# Altium schematic sheet ADC.SchDoc: ADC
size A; Organization: UCLA High Energy Physics; DocumentNumber: 8; Revision: 2.0; SheetNumber: 8; SheetTotal: 23; CurrentDate: 9/6/2018; ModifiedDate: 9/6/2018
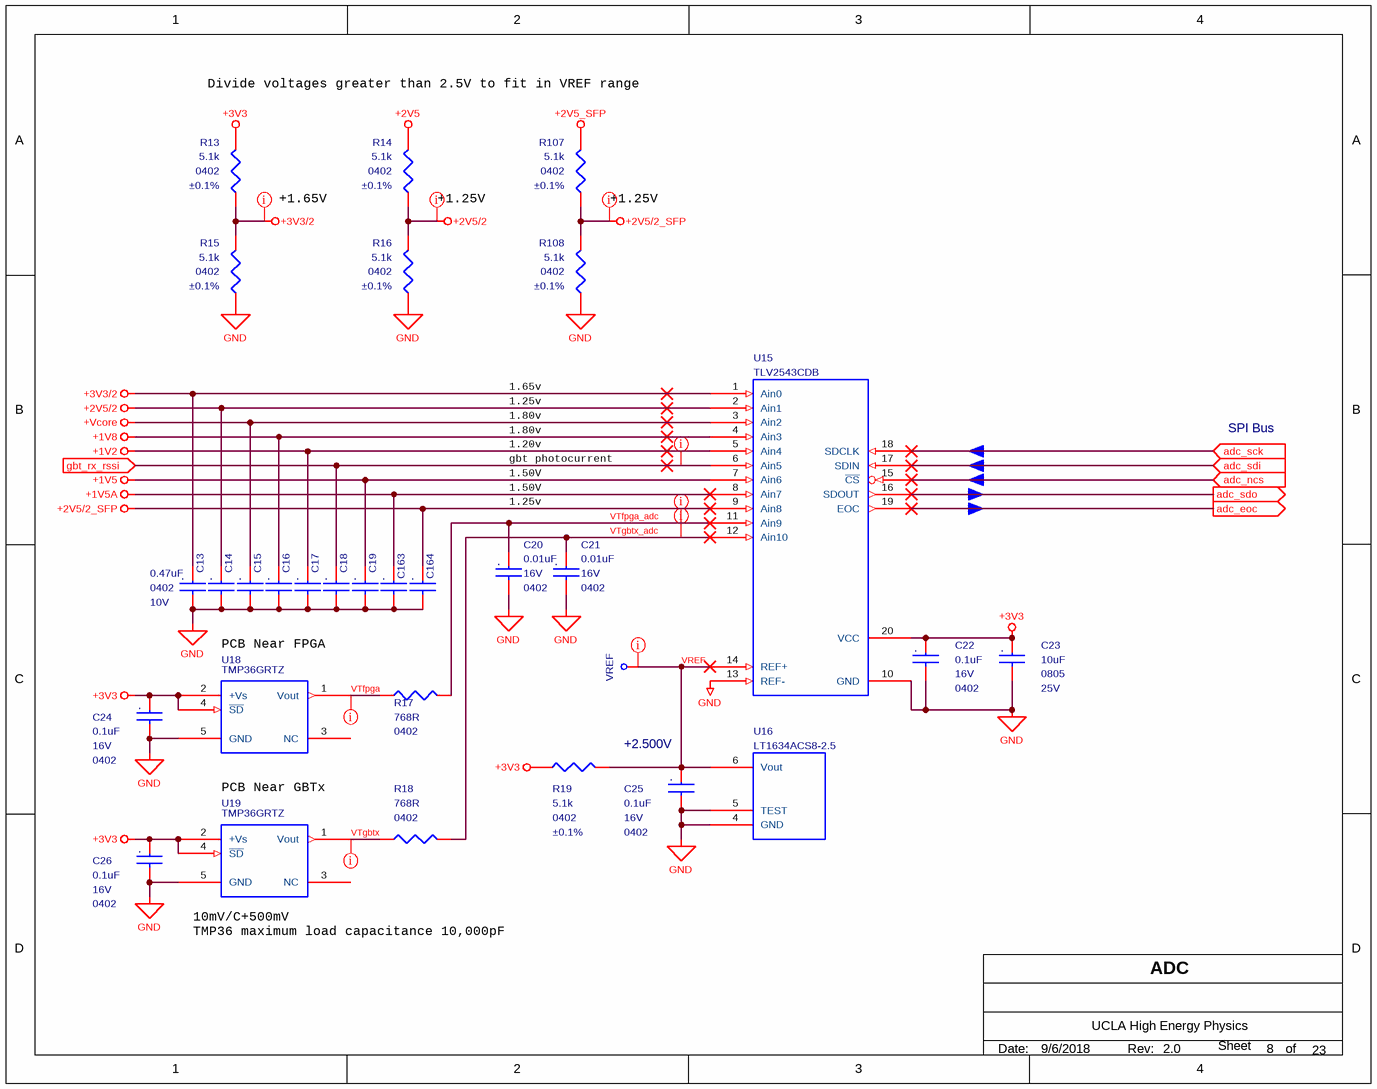
[diagram p0: ADC.SchDoc]

## Parts
C13  0.47uF  package: 0402  Voltage - Rated: 10V  [MC_S6/SM/C_0402_IPC]
C14  0.47uF  [MC_S6/SM/C_0402_IPC]  (value not drawn)
C15  0.47uF  [MC_S6/SM/C_0402_IPC]  (value not drawn)
C16  0.47uF  [MC_S6/SM/C_0402_IPC]  (value not drawn)
C17  0.47uF  [MC_S6/SM/C_0402_IPC]  (value not drawn)
C18  0.47uF  [MC_S6/SM/C_0402_IPC]  (value not drawn)
C19  0.47uF  [MC_S6/SM/C_0402_IPC]  (value not drawn)
C20  0.01uF  Voltage - Rated: 16V  package: 0402  [MC_S6/SM/C_0402_IPC]
C21  0.01uF  Voltage - Rated: 16V  package: 0402  [MC_S6/SM/C_0402_IPC]
C22  0.1uF  package: 0402  Voltage - Rated: 16V  [MC_S6/SM/C_0402_IPC]
C23  10uF  Voltage - Rated: 25V  package: 0805  [MC_S6/SM/C_0805_IPC]
C24  0.1uF  package: 0402  Voltage - Rated: 16V  [MC_S6/SM/C_0402_IPC]
C25  0.1uF  package: 0402  Voltage - Rated: 16V  [MC_S6/SM/C_0402_IPC]
C26  0.1uF  package: 0402  Voltage - Rated: 16V  [MC_S6/SM/C_0402_IPC]
C163  0.47uF  [MC_S6/SM/C_0402_IPC]  (value not drawn)
C164  0.47uF  [MC_S6/SM/C_0402_IPC]  (value not drawn)
R13  5.1k  Tolerance: ±0.1%  Supplier Device Package: 0402  [MC_S6/SM/R_0402_IPC]
R14  5.1k  Tolerance: ±0.1%  Supplier Device Package: 0402  [MC_S6/SM/R_0402_IPC]
R15  5.1k  Tolerance: ±0.1%  Supplier Device Package: 0402  [MC_S6/SM/R_0402_IPC]
R16  5.1k  Tolerance: ±0.1%  Supplier Device Package: 0402  [MC_S6/SM/R_0402_IPC]
R17  768R  Supplier Device Package: 0402  [MC_S6/SM/R_0402_IPC]
R18  768R  Supplier Device Package: 0402  [MC_S6/SM/R_0402_IPC]
R19  5.1k  Tolerance: ±0.1%  Supplier Device Package: 0402  [MC_S6/SM/R_0402_IPC]
R107  5.1k  Tolerance: ±0.1%  Supplier Device Package: 0402  [MC_S6/SM/R_0402_IPC]
R108  5.1k  Tolerance: ±0.1%  Supplier Device Package: 0402  [MC_S6/SM/R_0402_IPC]
U15  TLV2543CDB  [MC_S6/SM/ADC_DB20]
U16  LT1634ACS8-2.5  [MC_S6/SM/LT1634_SOIC8]
U18  TMP36GRTZ  [MC_S6/SM/SOT23_RJ5]
U19  TMP36GRTZ  [MC_S6/SM/SOT23_RJ5]
VREF  Test Point Via  [MC_S6/TH/TPVIA]  (value not drawn)  (no BOM)

## Ports
adc_eoc (out), adc_ncs (in), adc_sck (in), adc_sdi (in), adc_sdo (out), gbt_rx_rssi (in)

## Nets
+1V2: C17.1 U15.5(Ain4)
+1V5: C19.1 U15.7(Ain6)
+1V5A: C163.1 U15.8(Ain7)
+1V8: C16.1 U15.4(Ain3)
+2V5: R14.1
+2V5/2: C14.1 R14.2 R16.1 U15.2(Ain1)
+2V5/2_SFP: C164.1 R107.2 R108.1 U15.9(Ain8)
+2V5_SFP: R107.1
+3V3: C22.1 C23.1 C24.1 C26.1 R13.1 R19.1 U15.20(VCC) U18.2(+Vs) U18.4(~{SD}) U19.2(+Vs) U19.4(~{SD})
+3V3/2: C13.1 R13.2 R15.1 U15.1(Ain0)
+Vcore: C15.1 U15.3(Ain2)
GND: C13.2 C14.2 C15.2 C16.2 C17.2 C18.2 C19.2 C20.2 C21.2 C22.2 C23.2 C24.2 C25.2 C26.2 C163.2 C164.2 R15.2 R16.2 R108.2 U15.10(GND) U15.13(REF-) U16.4(GND) U16.5(TEST) U18.5(GND) U19.5(GND)
adc_eoc: U15.19(EOC) ; port adc_eoc
adc_ncs: U15.15(~{CS}) ; port adc_ncs
adc_sck: U15.18(SDCLK) ; port adc_sck
adc_sdi: U15.17(SDIN) ; port adc_sdi
adc_sdo: U15.16(SDOUT) ; port adc_sdo
gbt_rx_rssi: C18.1 U15.6(Ain5) ; port gbt_rx_rssi
VREF: C25.1 R19.2 U15.14(REF+) U16.6(Vout) VREF.1(In)
VTfpga: R17.1 U18.1(Vout)
VTfpga_adc: C20.1 R17.2 U15.11(Ain9)
VTgbtx: R18.1 U19.1(Vout)
VTgbtx_adc: C21.1 R18.2 U15.12(Ain10)

Not connected (* = marked no-connect by the designer): U18 3(NC); U19 3(NC)

## Layout directives
net class Power: +2V5/2, +2V5/2_SFP, +3V3/2, gbt_rx_rssi, VREF, VTfpga, VTfpga_adc, VTgbtx, VTgbtx_adc

## Notes on the sheet
- Divide voltages greater than 2.5V to fit in VREF range
- +1.65V
- (near R14) +1.25V
- (near R107) +1.25V
- 1.65v
- 1.25v
- 1.80v
- 1.20v
- gbt photocurrent
- SPI Bus
- 1.50V
- PCB Near FPGA
- +2.500V
- PCB Near GBTx
- (near U19) 10mV/C+500mV
- (near U19) TMP36 maximum load capacitance 10,000pF
- Date:
- Rev:
- of
- Sheet
- (in symbol C0402C103K4RACTU) .
- (in symbol C0402C104K4RACTU) .
- (in symbol GRM21BR61E106KA73L) .
- (in symbol GRM155R61A474KE15D) .

## Library data of the parts
C13-C19 C163 C164 = GRM155R61A474KE15D: CAP CER 0.47UF 10V X5R 0402; Manufacturer: Murata Electronics North America; Capacitance: 0.47µF; Tolerance: ±10%; Supplier 1: Digi-Key; Manufacturer Part Number: GRM155R61A474KE15D; RoHS: RoHS Compliant; Category: Capacitors; Stock 1: 506743; Pricing 1: 1=0.1, 10=0.064, 50=0.0344, 100=0.0292, 250=0.02384, 500=0.0204, 1000=0.0159, 5000=0.01325 (USD); Packaging: Cut Tape (CT); Part Status: Active; Operating Temperature: -55°C ~ 85°C; Features: -; Ratings: -; Applications: General Purpose; Mounting Type: Surface Mount, MLCC; Package / Case: 0402 (1005 Metric); Size / Dimension: 0.039" L x 0.020" W (1.00mm x 0.50mm); Height - Seated (Max): -; Thickness (Max): 0.022" (0.55mm); Lead Spacing: -; ComponentLink1URL: http://www.murata.com/~/media/webrenewal/support/library/catalog/products/capacitor/mlcc/c02e.pdf; ComponentLink1Description: http://www.murata.com/~/media/webrenewal/support/library/catalog/products/capacitor/mlcc/c02e.pdf; Supplier 2: Digi-Key; Stock 2: 506743; Pricing 2: 1=0.1, 10=0.064, 50=0.0344, 100=0.0292, 250=0.02384, 500=0.0204, 1000=0.0159, 5000=0.01325 (USD); Supplier Part Number 1: 490-3264-1-ND; Supplier Part Number 2: 490-3264-6-ND; Temperature Coefficient: X5R; Lead Style: -
  C14-C19 C163 C164: package: 0402; Voltage - Rated: 10V
C20 C21 = C0402C103K4RACTU: CAP CER 10nF 16V X7R 0402; Manufacturer: KEMET; Capacitance: 10000pF; Tolerance: ±10%; Supplier 1: Digi-Key; Manufacturer Part Number: C0402C103K4RACTU; RoHS: RoHS Compliant; Category: Capacitors; Stock 1: 605739; Pricing 1: 1=0.1, 10=0.02, 25=0.0144, 50=0.0108, 100=0.0088, 250=0.00732, 500=0.00626, 1000=0.00492, 5000=0.00412 (USD); Packaging: Cut Tape (CT); Part Status: Active; Temperature Coefficient: X7R; Operating Temperature: -55°C ~ 125°C; Features: -; Ratings: -; Applications: General Purpose; Mounting Type: Surface Mount, MLCC; Package / Case: 0402 (1005 Metric); Size / Dimension: 0.039" L x 0.020" W (1.00mm x 0.50mm); Height - Seated (Max): -; Thickness (Max): 0.022" (0.55mm); Lead Spacing: -; Lead Style: -; ComponentLink1URL: http://www.kemet.com/docfinder?Partnumber=C0402C103K4RACTU; ComponentLink1Description: http://www.kemet.com/docfinder?Partnumber=C0402C103K4RACTU; Supplier 2: Digi-Key; Stock 2: 605739; Pricing 2: 1=0.1, 10=0.02, 25=0.0144, 50=0.0108, 100=0.0088, 250=0.00732, 500=0.00626, 1000=0.00492, 5000=0.00412 (USD); Supplier Part Number 1: 399-1038-1-ND; Supplier Part Number 2: 399-1038-6-ND; Failure Rate: -
C22 C24-C26 = C0402C104K4RACTU: CAP CER 0.1UF 16V X7R 0402; Manufacturer: KEMET; Capacitance: 0.10µF; Tolerance: ±10%; Supplier 1: Digi-Key; Manufacturer Part Number: C0402C104K4RACTU; RoHS: RoHS Compliant; Category: Capacitors; Stock 1: 3565698; Pricing 1: 1=0.11, 10=0.078, 25=0.0568, 50=0.0442, 100=0.0365, 250=0.03024, 500=0.02562, 1000=0.02121, 5000=0.01806 (USD); Packaging: Cut Tape (CT); Part Status: Active; Operating Temperature: -55°C ~ 125°C; Features: -; Ratings: -; Applications: General Purpose; Failure Rate: -; Mounting Type: Surface Mount, MLCC; Package / Case: 0402 (1005 Metric); Size / Dimension: 0.039" L x 0.020" W (1.00mm x 0.50mm); Height - Seated (Max): -; Thickness (Max): 0.022" (0.55mm); Lead Spacing: -; Lead Style: -; ComponentLink1URL: http://www.kemet.com/docfinder?Partnumber=C0402C104K4RACTU; ComponentLink1Description: http://www.kemet.com/docfinder?Partnumber=C0402C104K4RACTU; Supplier 2: Digi-Key; Stock 2: 3565998; Pricing 2: 1=0.11, 10=0.078, 25=0.0568, 50=0.0442, 100=0.0365, 250=0.03024, 500=0.02562, 1000=0.02121, 5000=0.01806 (USD); Supplier Part Number 1: 399-3521-1-ND; Supplier Part Number 2: 399-3521-6-ND; Temperature Coefficient: X7R
C23 = GRM21BR61E106KA73L: CAP CER 10UF 25V X5R 0805; Manufacturer: Murata Electronics North America; Capacitance: 10µF; Tolerance: ±10%; Supplier 1: Digi-Key; Manufacturer Part Number: GRM21BR61E106KA73L; RoHS: RoHS Compliant; Category: Capacitors; Stock 1: 607428; Pricing 1: 1=0.19, 10=0.13, 50=0.0748, 100=0.0618, 250=0.052, 500=0.04356, 1000=0.03575 (USD); Packaging: Cut Tape (CT); Part Status: Active; Temperature Coefficient: X5R; Operating Temperature: -55°C ~ 85°C; Features: -; Ratings: -; Applications: General Purpose; Mounting Type: Surface Mount, MLCC; Package / Case: 0805 (2012 Metric); Size / Dimension: 0.079" L x 0.049" W (2.00mm x 1.25mm); Height - Seated (Max): -; Thickness (Max): 0.053" (1.35mm); Lead Spacing: -; Lead Style: -; ComponentLink1URL: http://www.murata.com/~/media/webrenewal/support/library/catalog/products/capacitor/mlcc/c02e.pdf; ComponentLink1Description: http://www.murata.com/~/media/webrenewal/support/library/catalog/products/capacitor/mlcc/c02e.pdf; Supplier 2: Digi-Key; Supplier Part Number 1: 490-5523-1-ND; Supplier Part Number 2: 490-5523-6-ND
R13-R16 R19 R107 R108 = ERA-2AEB512X: RES SMD 5.1K OHM 0.1% 1/16W 0402; Manufacturer: Panasonic Electronic Components; Power (Watts): 0.063W, 1/16W; Temperature Coefficient: ±25ppm/°C; Supplier 1: Digi-Key; Manufacturer Part Number: ERA-2AEB512X; RoHS: RoHS Compliant; Category: Resistors; Stock 1: 26098; Pricing 1: 1=0.61, 50=0.238, 100=0.1913, 250=0.14876, 500=0.1122, 1000=0.0867, 5000=0.0646 (USD); Packaging: Cut Tape (CT); Part Status: Active; Resistance (Ohms): 5.1k; Composition: Thin Film; Features: Automotive AEC-Q200; Operating Temperature: -55°C ~ 155°C; Package / Case: 0402 (1005 Metric); Size / Dimension: 0.039" L x 0.020" W (1.00mm x 0.50mm); Height - Seated (Max): 0.016" (0.40mm); Number of Terminations: 2; Failure Rate: -; ComponentLink1URL: https://industrial.panasonic.com/cdbs/www-data/pdf/RDA0000/AOA0000C237.pdf; ComponentLink1Description: https://industrial.panasonic.com/cdbs/www-data/pdf/RDA0000/AOA0000C237.pdf; Supplier 2: Digi-Key; Stock 2: 26098; Pricing 2: 1=0.61, 50=0.238, 100=0.1913, 250=0.14876, 500=0.1122, 1000=0.0867, 5000=0.0646 (USD); Supplier Part Number 1: P5.1KDCCT-ND; Supplier Part Number 2: P5.1KDCDKR-ND
R17 R18 = ERJ-2RKF7680X: RES SMD 768 OHM 5.0% 1/10W 0402; Manufacturer: Panasonic Electronic Components; Tolerance: ±1%; Power (Watts): 0.1W, 1/10W; Temperature Coefficient: ±100ppm/°C; Supplier 1: Digi-Key; Manufacturer Part Number: ERJ-2RKF7680X; RoHS: RoHS Compliant; Category: Resistors; Stock 1: 54378; Pricing 1: 1=0.1, 10=0.039, 100=0.016, 1000=0.00719, 2500=0.00624, 5000=0.00515 (USD); Packaging: Cut Tape (CT); Part Status: Active; Composition: Thick Film; Features: Automotive AEC-Q200; Operating Temperature: -55°C ~ 155°C; Package / Case: 0402 (1005 Metric); Size / Dimension: 0.039" L x 0.020" W (1.00mm x 0.50mm); Height - Seated (Max): 0.016" (0.40mm); Failure Rate: -; ComponentLink1URL: https://industrial.panasonic.com/cdbs/www-data/pdf/RDA0000/AOA0000C304.pdf; ComponentLink1Description: https://industrial.panasonic.com/cdbs/www-data/pdf/RDA0000/AOA0000C304.pdf; Supplier 2: Digi-Key; Stock 2: 54378; Pricing 2: 1=0.1, 10=0.039, 100=0.016, 1000=0.00719, 2500=0.00624, 5000=0.00515 (USD); Supplier Part Number 1: P768LCT-ND; Supplier Part Number 2: P768LDKR-ND
U15 = TLV2543CDB: IC SERIAL OUT A/D 11-CH 20-SSOP; Manufacturer: Texas Instruments; Manufacturer Part Number: TLV2543CDBR; COMPSIDE: TOP; COMPGROUP: 0; COMPROT: 270; mfgr: Texas Inst; mfgr_foot: DB20; Number of Bits: 12; Sampling Rate (Per Second): 66k; Number of Inputs: 11; Input Type: Single Ended; Data Interface: SPI; Configuration: MUX-S/H-ADC; Ratio - S/H:ADC: 1:1; Number of A/D Converters: 1; Architecture: SAR; Reference Type: External; Voltage - Supply, Analog: 3 V ~ 3.6 V; mfgr_id: TLV2543CDB; Supplier 1: Digi-Key; RoHS: RoHS Compliant; Category: Integrated Circuits (ICs); Stock 1: 505; Pricing 1: 1=12.64, 10=11.596, 100=9.7894, 500=8.68224, 1000=7.98299 (USD); Packaging: Cut Tape (CT); Part Status: Active; Voltage - Supply, Digital: 3 V ~ 3.6 V; Features: -; Operating Temperature: 0°C ~ 70°C; Package / Case: 20-SSOP (0.209", 5.30mm Width); Supplier Device Package: 20-SSOP; ComponentLink1URL: http://www.ti.com/lit/ds/symlink/tlv2543.pdf; ComponentLink1Description: http://www.ti.com/lit/ds/symlink/tlv2543.pdf; Supplier 2: Digi-Key; Stock 2: 505; Pricing 2: 1=12.64, 10=11.596, 100=9.7894, 500=8.68224, 1000=7.98299 (USD); Supplier Part Number 1: 296-10643-1-ND; Supplier Part Number 2: 296-10643-6-ND
U16 = LT1634_2.5V: IC VREF SHUNT 2.5V 8SOIC; Manufacturer: Linear Technology; Manufacturer Part Number: LT1634ACS8-2.5#PBF; COMPSIDE: TOP; COMPGROUP: 0; COMPROT: 270; mfgr: Linear Tech; mfgr_foot: SOIC8; Output Type: Fixed; Current - Output: 50mA; Tolerance: ±0.05%; Temperature Coefficient: 10ppm/°C; Noise - 0.1Hz to 10Hz: 15µVp-p; Current - Cathode: 8µA; mfgr_id: LT1634ACS8-2.5; Supplier 1: Digi-Key; RoHS: RoHS Compliant; Category: Integrated Circuits (ICs); Stock 1: 1010; Pricing 1: 1=9.42, 25=6.256, 100=4.7109 (USD); Packaging: Tube; Part Status: Active; Reference Type: Shunt; Voltage - Output (Min/Fixed): 2.5V; Voltage - Output (Max): -; Noise - 10Hz to 10kHz: -; Voltage - Input: -; Current - Supply: -; Operating Temperature: 0°C ~ 70°C (TA); Mounting Type: Surface Mount; Package / Case: 8-SOIC (0.154", 3.90mm Width); Supplier Device Package: 8-SOIC; ComponentLink1URL: http://www.linear.com/docs/3209; ComponentLink1Description: http://www.linear.com/docs/3209; Supplier Part Number 1: LT1634ACS8-2.5#PBF-ND
U18 U19 = TMP36GRTZ: SENSOR TEMP ANLG VOLT SOT-23-5; Manufacturer: Analog Devices; Manufacturer Part Number: TMP36GRTZ-REEL7; Output Type: Analog; Description: ANALOG DEVICES         TMP36GRTZ-REEL7            Temperature Sensor IC, Voltage,  3C, -40 C, +125 C, SOT-23, 5 Pins; Min Supply Voltage: 2.7V; Max Supply Voltage: 5.5V; Operating Supply Current: 50uA; Supplier 1: Digi-Key; Stock 1: 18393; Pricing 1: 1=1.75, 10=1.574, 100=1.2652, 500=1.0395, 1000=0.8613 (USD); Packaging: Tape and Reel; ComponentLink1URL: http://www.analog.com/media/en/technical-documentation/data-sheets/TMP35_36_37.pdf; ComponentLink1Description: http://www.analog.com/media/en/technical-documentation/data-sheets/TMP35_36_37.pdf; Supplier Part Number 1: TMP36GRTZ-REEL7CT-ND; Case/Package: SOT-23; Number of Pins: 5; Min Operating Temperature: -40°C; Max Operating Temperature: 125°C; Interface: Analog; Package Quantity: 3000; Nominal Supply Current: 50uA; Output Current: 50uA; Length: 3mm; Height: 1.3mm; Width: 1.7mm; Radiation Hardening: No; REACH SVHC: No SVHC; Lead Free: Contains Lead
VREF = TPVIA: COMPSIDE: TOP; COMPGROUP: 0; mfgr: Layout; COMPROT: 0; Package: 90; mfgr_id: TPVIA; mfgr_foot: TPVIA